# Altium schematic sheet 14D431K_C490697321_14D431K_C49069732.schdoc
size 127 x 101 mm
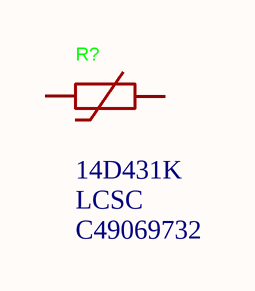
[diagram p0: 14D431K_C490697321_14D431K_C49069732.schdoc]

## Parts
R?  Supplier Part: C49069732  Manufacturer Part: 14D431K  Supplier: LCSC  [RES-TH_L14.5-W6.0-P7.50-D0.8-S6.0]  (hidden comment: 440pF)

## Nets

Not connected (* = marked no-connect by the designer): R? 1 2

## Library data of the parts
R? = 14D431K_C49069732: Manufacturer: R+O(宏嘉诚); Add into BOM: yes; Varistor Voltage: 387V~473V; Clamping Voltage: 710V; Maximum DC Volts: 350V; Maximum AC Volts: 275V; Peak Current: 4.5kA; Energy: 136J; Rated Wattage: 600mW; Symbol: 14D431K_C49069732; Device: 14D431K_C49069732; LCSC Part Name: 710V 136J; Supplier Footprint: 插件,P=7.5mm; JLCPCB Part Class: Extended Part; Datasheet: https://item.szlcsc.com/datasheet/14D431K/51445298.html; Convert to PCB: yes; Value: 440pF